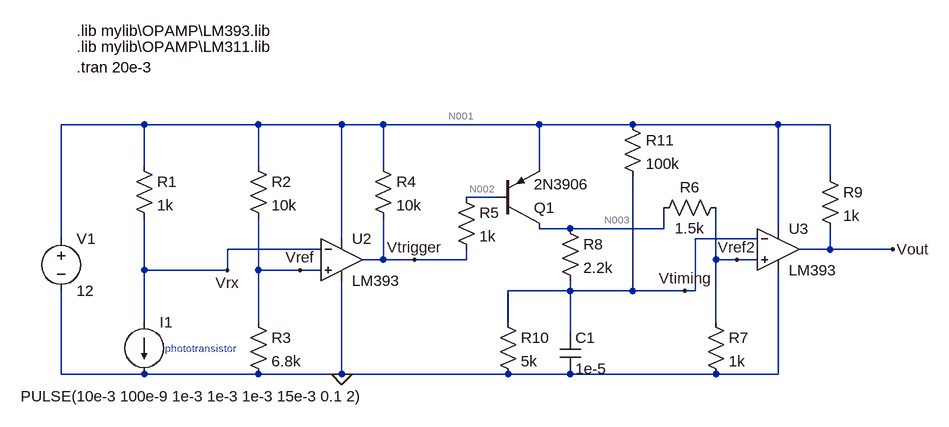
[diagram p0: schematic OpticalSwitch.asc]
OpticalSwitch.asc, the LTspice schematic file:
Version 4
SHEET 1 1080 680
WIRE -144 -64 -272 -64
WIRE 32 -64 -144 -64
WIRE 160 -64 32 -64
WIRE 224 -64 160 -64
WIRE 464 -64 224 -64
WIRE 608 -64 464 -64
WIRE 832 -64 608 -64
WIRE 912 -64 832 -64
WIRE -144 0 -144 -64
WIRE 32 0 32 -64
WIRE 224 0 224 -64
WIRE 464 0 464 -64
WIRE 912 16 912 -64
WIRE 400 48 352 48
WIRE 512 96 464 96
WIRE 656 96 656 64
WIRE 656 96 512 96
WIRE 832 96 832 -64
WIRE -272 112 -272 -64
WIRE 160 112 160 -64
WIRE 800 112 704 112
WIRE 128 128 -16 128
WIRE 912 128 912 96
WIRE 912 128 864 128
WIRE 1008 128 912 128
WIRE 224 144 224 80
WIRE 224 144 192 144
WIRE 272 144 224 144
WIRE 352 144 352 128
WIRE 352 144 272 144
WIRE 736 144 736 64
WIRE 768 144 736 144
WIRE 800 144 768 144
WIRE -144 160 -144 80
WIRE -16 160 -16 128
WIRE -16 160 -144 160
WIRE 32 160 32 80
WIRE 96 160 32 160
WIRE 128 160 96 160
WIRE 512 192 512 176
WIRE 512 192 416 192
WIRE 608 192 608 16
WIRE 608 192 512 192
WIRE 688 192 608 192
WIRE 704 192 704 112
WIRE 704 192 688 192
WIRE -144 240 -144 160
WIRE 32 240 32 160
WIRE 416 240 416 192
WIRE 736 240 736 144
WIRE 512 256 512 192
WIRE -272 320 -272 192
WIRE -144 320 -272 320
WIRE 32 320 -144 320
WIRE 160 320 160 176
WIRE 160 320 32 320
WIRE 416 320 160 320
WIRE 512 320 416 320
WIRE 736 320 512 320
WIRE 832 320 832 160
WIRE 832 320 736 320
FLAG -16 160 Vrx
FLAG 272 144 Vtrigger
FLAG 160 320 0
FLAG 1008 128 Vout
FLAG 768 144 Vref2
FLAG 688 192 Vtiming
FLAG 96 160 Vref
SYMBOL voltage -272 96 R0
WINDOW 123 0 0 Left 0
WINDOW 39 0 0 Left 0
SYMATTR InstName V1
SYMATTR Value 12
SYMBOL current -144 240 R0
WINDOW 3 -190 114 Left 2
WINDOW 123 0 0 Left 0
WINDOW 39 0 0 Left 0
SYMATTR Value PULSE(10e-3 100e-9 1e-3 1e-3 1e-3 15e-3 0.1 2)
SYMATTR InstName I1
SYMBOL res -160 -16 R0
SYMATTR InstName R1
SYMATTR Value 1k
SYMBOL res 16 -16 R0
SYMATTR InstName R2
SYMATTR Value 10k
SYMBOL res 16 224 R0
SYMATTR InstName R3
SYMATTR Value 6.8k
SYMBOL res 208 -16 R0
SYMATTR InstName R4
SYMATTR Value 10k
SYMBOL pnp 400 96 M180
SYMATTR InstName Q1
SYMATTR Value 2N3906
SYMBOL res 336 32 R0
SYMATTR InstName R5
SYMATTR Value 1k
SYMBOL res 640 80 R270
WINDOW 0 32 56 VTop 2
WINDOW 3 0 56 VBottom 2
SYMATTR InstName R6
SYMATTR Value 1.5k
SYMBOL res 720 224 R0
SYMATTR InstName R7
SYMATTR Value 1k
SYMBOL res 496 80 R0
SYMATTR InstName R8
SYMATTR Value 2.2k
SYMBOL cap 496 256 R0
SYMATTR InstName C1
SYMATTR Value 1e-5
SYMBOL res 896 0 R0
SYMATTR InstName R9
SYMATTR Value 1k
SYMBOL Opamps\\opamp2 160 80 R0
SYMATTR InstName U2
SYMATTR Value LM393
SYMBOL Opamps\\opamp2 832 64 R0
SYMATTR InstName U3
SYMATTR Value LM393
SYMBOL res 400 224 R0
SYMATTR InstName R10
SYMATTR Value 5k
SYMBOL res 592 -80 R0
SYMATTR InstName R11
SYMATTR Value 100k
TEXT -248 -184 Left 2 !.lib mylib\\OPAMP\\LM311.lib
TEXT -248 -152 Left 2 !.tran 20e-3
TEXT -248 -208 Left 2 !.lib mylib\\OPAMP\\LM393.lib
TEXT -112 280 Left 1 ;phototransistor

The netlist it stands for:
* OpticalSwitch.asc
V1 N001 0 12
I1 Vrx 0 PULSE(10e-3 100e-9 1e-3 1e-3 1e-3 15e-3 0.1 2)
R1 N001 Vrx 1k
R2 N001 Vref 10k
R3 Vref 0 6.8k
R4 N001 Vtrigger 10k
Q1 N003 N002 N001 0 2N3906
R5 N002 Vtrigger 1k
R6 N003 Vref2 1.5k
R7 Vref2 0 1k
R8 N003 Vtiming 2.2k
C1 Vtiming 0 1e-5
R9 N001 Vout 1k
XU2 Vref Vrx N001 0 Vtrigger LM393  ; pins In+ In- V+ V- OUT
XU3 Vref2 Vtiming N001 0 Vout LM393  ; pins In+ In- V+ V- OUT
R10 Vtiming 0 5k
R11 N001 Vtiming 100k
.model NPN NPN
.model PNP PNP
.lib standard.bjt
.lib mylib\OPAMP\LM311.lib
.tran 20e-3
.lib mylib\OPAMP\LM393.lib
* phototransistor
.backanno
.end

* Results of the author's LTspice run, read from the files saved beside the schematic
* Operating Point, zero values left out:
*   V(n001) = 12 V
*   V(vrx) = 2 V
*   V(vref) = 4.857 V
*   V(vtrigger) = 12 V
*   V(n003) = 151 mV
*   V(n002) = 12 V
*   V(vref2) = 60.44 mV
*   V(vtiming) = 283.9 mV
*   V(vout) = 124.2 mV
*   Ic(Q1) = -11.86 pA
*   Ib(Q1) = 11.85 pA
*   I(I1) = 10 mA
*   I(R11) = 117.2 µA
*   I(R10) = 56.77 µA
*   I(R9) = 11.88 mA
*   I(R8) = -60.39 µA
*   I(R7) = 60.44 µA
*   I(R6) = 60.39 µA
*   I(R5) = -11.85 pA
*   I(R4) = 23.84 pA
*   I(R3) = 714.3 µA
*   I(R2) = 714.3 µA
*   I(R1) = 10 mA
*   I(V1) = -23.33 mA
*   Ix(u2:1) = 7.786 pA
*   Ix(u2:2) = -49.97 nA
*   Ix(u2:3) = 359.2 µA
*   Ix(u2:4) = -359.1 µA
*   Ix(u2:5) = 11.98 pA
*   Ix(u3:1) = -49.97 nA
*   Ix(u3:2) = -8.692 pA
*   Ix(u3:3) = 259.3 µA
*   Ix(u3:4) = -12.14 mA
*   Ix(u3:5) = 11.88 mA
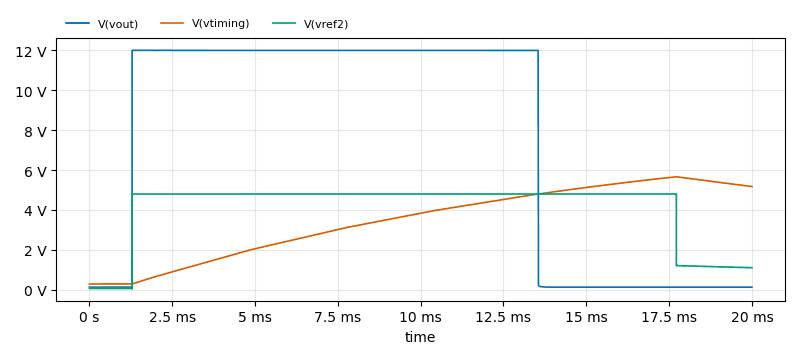
[diagram p1: Transient Analysis of OpticalSwitch.asc, plotted from the saved traces]
* Transient Analysis, 1 run:
*   V(vout): min 124.1 mV, max 12 V, average 7.406 V, rms 9.397 V, last 124.2 mV
*   V(vtiming): min 283.9 mV, max 5.663 V, average 3.464 V, rms 3.892 V, last 5.169 V
*   V(vref2): min 42.43 mV, max 4.797 V, average 4.075 V, rms 4.363 V, last 1.1 V